# Altium project ProjectTower3.PrjPCB
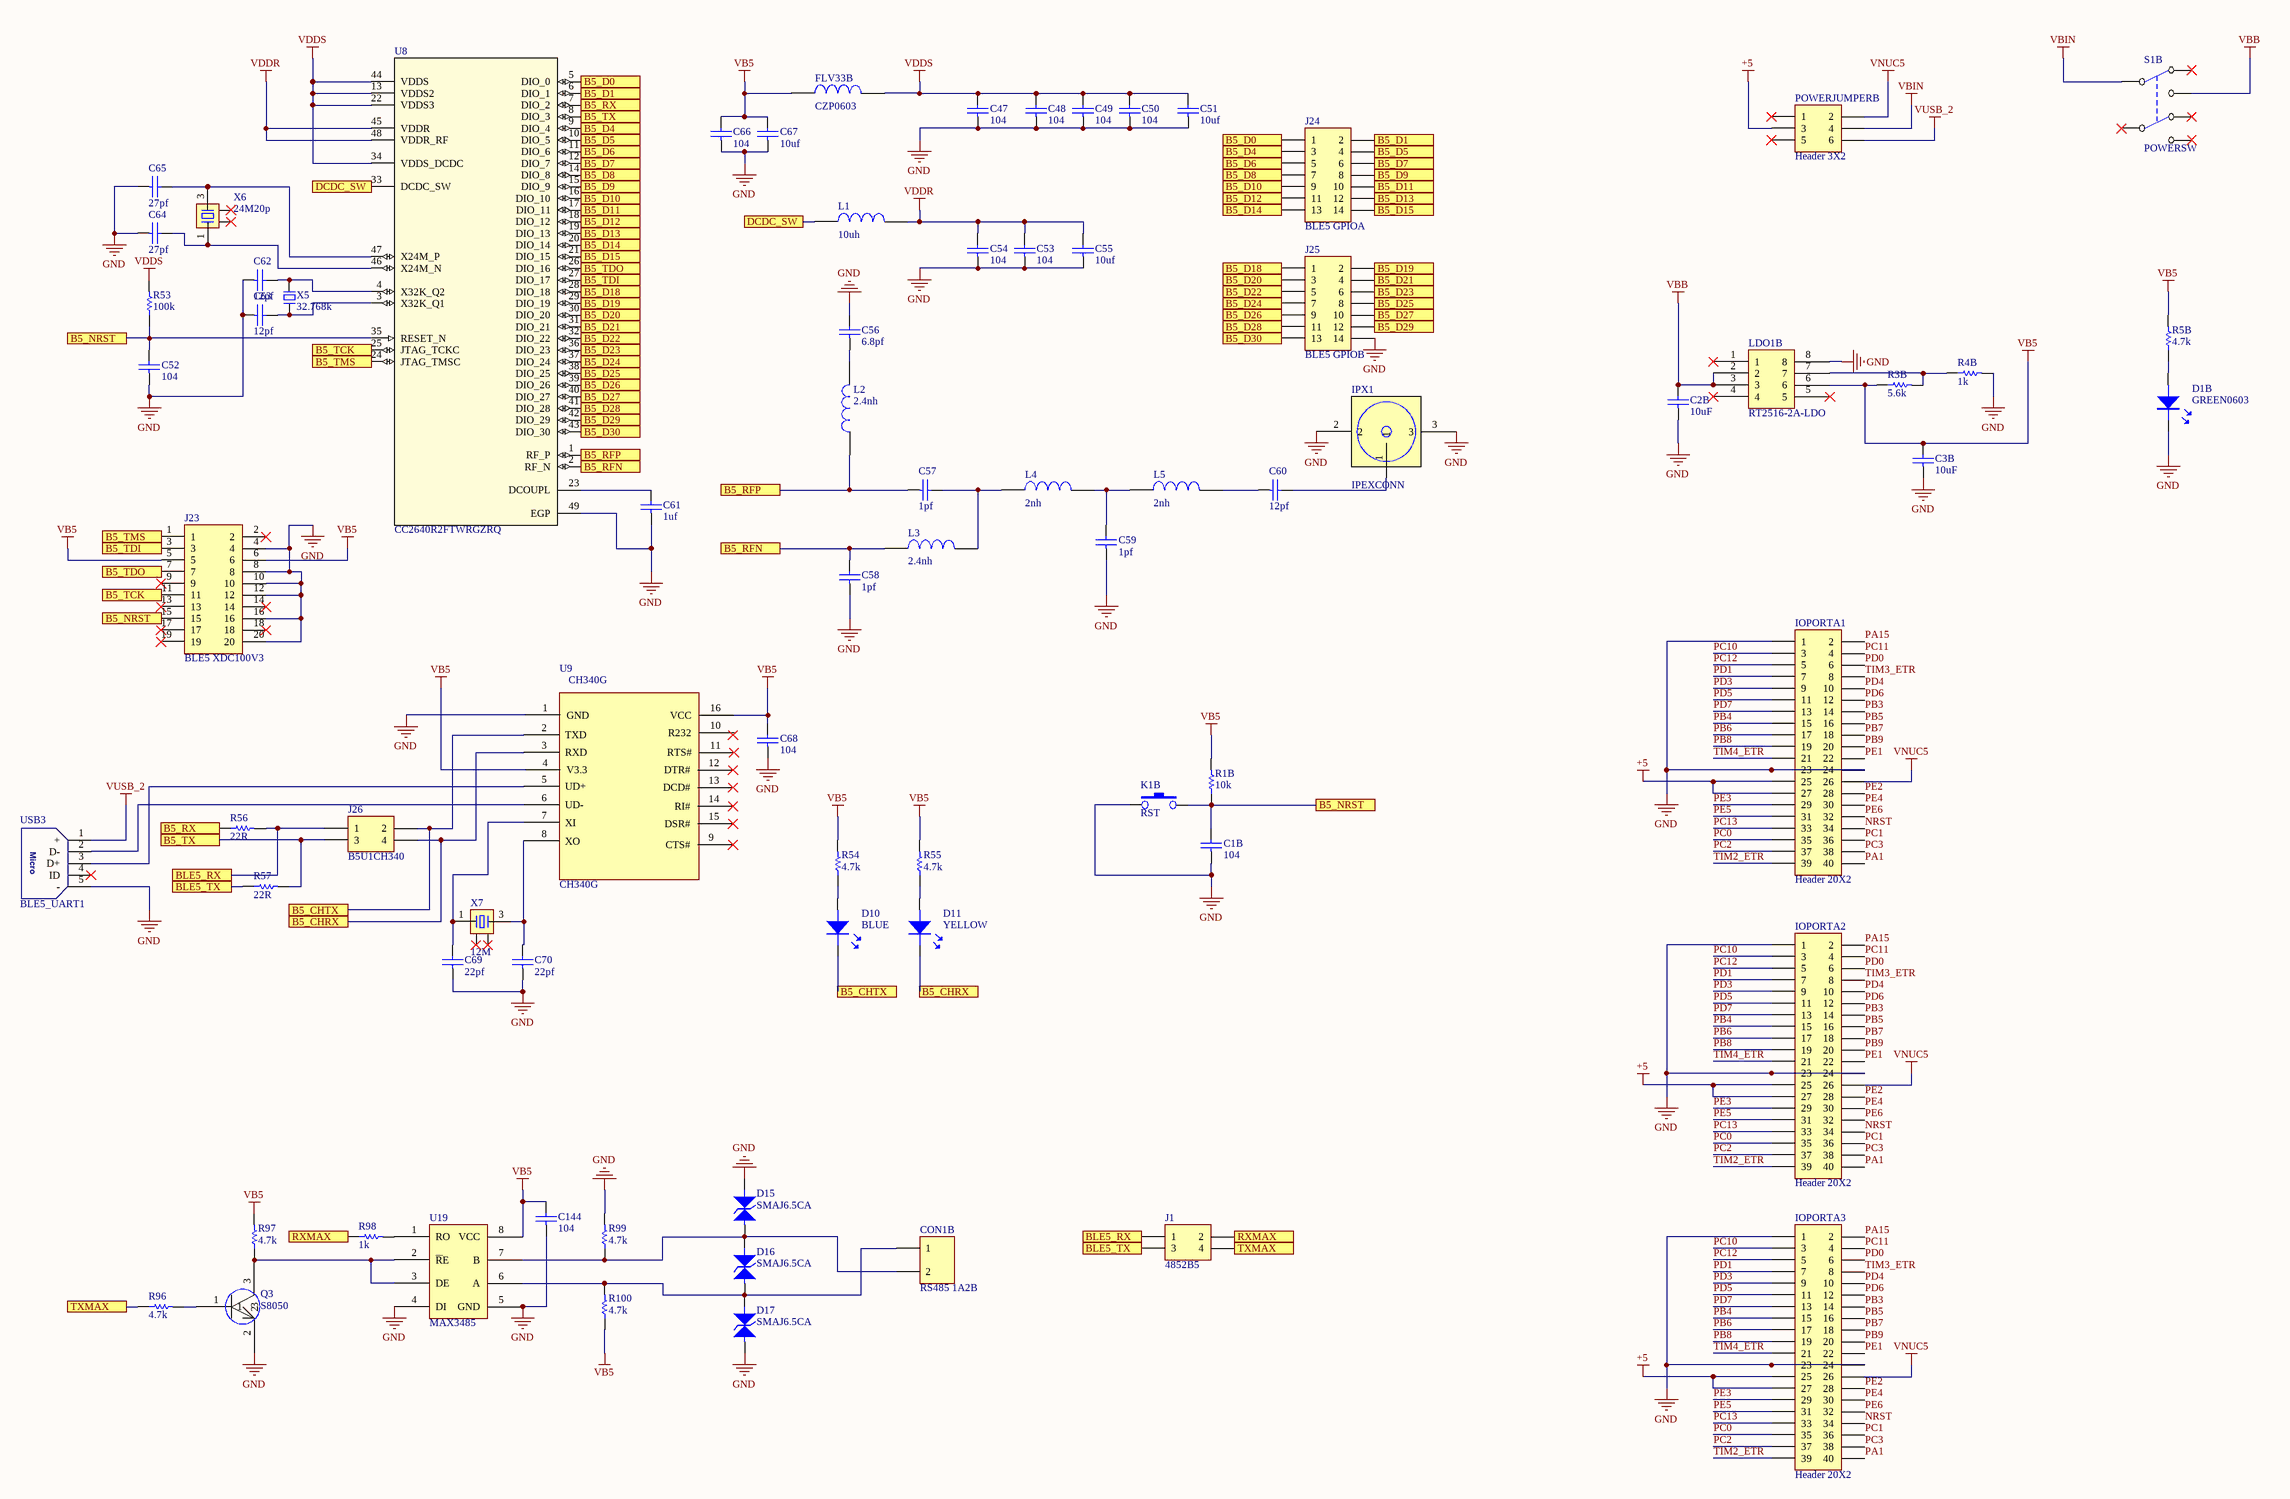
[diagram p0: Sheet3.SchDoc]
1 sheet, 76 parts. Net scope: flat (ports and power ports of the same name join across sheets).
Board file: PCB3.PcbDoc

## Sheet Sheet3.SchDoc
size A2

### Parts
C1B  104  [0603C]
C2B  10uF  [0805C]
C3B  10uF  [0805C]
C47  104  [0603C]
C48  104  [0603C]
C49  104  [0603C]
C50  104  [0603C]
C51  10uf  [0805C]
C52  104  [0603C]
C53  104  [0603C]
C54  104  [0603C]
C55  10uf  [0805C]
C56  6.8pf  [0603C]
C57  1pf  [0603C]
C58  1pf  [0603C]
C59  1pf  [0603C]
C60  12pf  [0603C]
C61  1uf  [0805C]
C62  12pf  [0603C]
C63  12pf  [0603C]
C64  27pf  [0603C]
C65  27pf  [0603C]
C66  104  [0603C]
C67  10uf  [0805C]
C68  104  [0603C]
C69  22pf  [0603C]
C70  22pf  [0603C]
C144  104  [0805C]
CON1B  RS485 1A2B  [KF301-2P]
D1B  GREEN0603  [LED-0603G]
D10  BLUE  [LED-0603B]
D11  YELLOW  [LED-0603Y]
D15  SMAJ6.5CA  [SMA/DO-214AC]
D16  SMAJ6.5CA  [SMA/DO-214AC]
D17  SMAJ6.5CA  [SMA/DO-214AC]
FLV33B  CZP0603  [0603L]
IOPORTA1  Header 20X2  [HDR2X20]
IOPORTA2  Header 20X2  [HDR2X20]
IOPORTA3  Header 20X2  [HDR2X20]
IPX1  IPEXCONN  [IPEXCONN]
J1  4852B5  [HDR2X2]
J23  BLE5 XDC100V3  [IDC2.54-20P]
J24  BLE5 GPIOA  [HDR2X7]
J25  BLE5 GPIOB  [HDR2X7]
J26  B5U1CH340  [HDR2X2]
K1B  RST  [DIP-6X6X5]
L1  10uh  [0805L]
L2  2.4nh  [0603L]
L3  2.4nh  [0603L]
L4  2nh  [0603L]
L5  2nh  [0603L]
LDO1B  RT2516-2A-LDO  [SOP8]
POWERJUMPERB  Header 3X2  [HDR2X3]
Q3  S8050  [SOT23]
R1B  10k  [0603R]
R3B  5.6k  [0603R]
R4B  1k  [0603R]
R5B  4.7k  [0603R]
R53  100k  [0603R]
R54  4.7k  [0603R]
R55  4.7k  [0603R]
R56  22R  [0603R]
R57  22R  [0603R]
R96  4.7k  [0603R]
R97  4.7k  [0603R]
R98  1k  [0603R]
R99  4.7k  [0603R]
R100  4.7k  [0603R]
S1B  POWERSW  [KFT DIP-7X7]
U8  CC2640R2FTWRGZRQ  [RGZ0048N]
U9  CH340G  [SOIC127P600X170-16N]
U19  MAX3485  [SOP8]
USB3  BLE5_UART1  [USB-micro_B]
X5  32.768k  [X3215]
X6  24M20p  [OSC 3225-4P]
X7  12M  [OSC 3225-4P]

### Ports
B5_CHRX, B5_CHTX, B5_D0, B5_D1, B5_D4, B5_D5, B5_D6, B5_D7, B5_D8, B5_D9, B5_D10, B5_D11, B5_D12, B5_D13, B5_D14, B5_D15, B5_D18, B5_D19, B5_D20, B5_D21, B5_D22, B5_D23, B5_D24, B5_D25, B5_D26, B5_D27, B5_D28, B5_D29, B5_D30, B5_NRST, B5_RFN, B5_RFP, B5_RX, B5_TCK, B5_TDI, B5_TDO, B5_TMS, B5_TX, BLE5_RX, BLE5_TX, DCDC_SW, RXMAX, TXMAX

### Nets
+5: IOPORTA1.25 IOPORTA1.27 IOPORTA2.25 IOPORTA2.27 IOPORTA3.25 IOPORTA3.27 POWERJUMPERB.3
GND: C1B.1 C2B.1 C3B.1 C47.1 C48.1 C49.1 C50.1 C51.1 C52.1 C53.1 C54.1 C55.1 C56.2 C58.1 C59.1 C61.1 C62.1 C63.1 C64.1 C65.1 C66.1 C67.1 C68.1 C69.1 C70.1 C144.1 D1B.K D15.K D17.A IOPORTA1.1 IOPORTA1.23 IOPORTA1.24 IOPORTA2.1 IOPORTA2.23 IOPORTA2.24 IOPORTA3.1 IOPORTA3.23 IOPORTA3.24 IPX1.2 IPX1.3 J23.4 J23.8 J23.10 J23.12 J23.16 J23.20 J25.14 K1B.1 LDO1B.8 Q3.2 R4B.2 R99.2 U8.49(EGP) U9.1(GND) U19.4(DI) U19.5(GND) USB3.5(-)
VB5: C3B.2 C66.2 C67.2 C68.2 C144.2 FLV33B.1 J23.5 J23.6 LDO1B.6 R1B.2 R3B.1 R5B.2 R54.2 R55.2 R97.2 R100.1 U9.4(V3.3) U9.16(VCC) U19.8(VCC)
VBB: C2B.2 LDO1B.2 LDO1B.3 S1B.1
VBIN: POWERJUMPERB.4 S1B.2
VDDR: C53.2 C54.2 C55.2 L1.2 U8.45(VDDR) U8.48(VDDR_RF)
VDDS: C47.2 C48.2 C49.2 C50.2 C51.2 FLV33B.2 R53.2 U8.13(VDDS2) U8.22(VDDS3) U8.34(VDDS_DCDC) U8.44(VDDS)
VNUC5: IOPORTA1.26 IOPORTA2.26 IOPORTA3.26 POWERJUMPERB.2
VUSB_2: POWERJUMPERB.6 USB3.1(+)
NRST: IOPORTA1.34 IOPORTA2.34 IOPORTA3.34
PA1: IOPORTA1.40 IOPORTA2.40 IOPORTA3.40
PA15: IOPORTA1.2 IOPORTA2.2 IOPORTA3.2
PB3: IOPORTA1.14 IOPORTA2.14 IOPORTA3.14
PB4: IOPORTA1.15 IOPORTA2.15 IOPORTA3.15
PB5: IOPORTA1.16 IOPORTA2.16 IOPORTA3.16
PB6: IOPORTA1.17 IOPORTA2.17 IOPORTA3.17
PB7: IOPORTA1.18 IOPORTA2.18 IOPORTA3.18
PB8: IOPORTA1.19 IOPORTA2.19 IOPORTA3.19
PB9: IOPORTA1.20 IOPORTA2.20 IOPORTA3.20
PC0: IOPORTA1.35 IOPORTA2.35 IOPORTA3.35
PC1: IOPORTA1.36 IOPORTA2.36 IOPORTA3.36
PC2: IOPORTA1.37 IOPORTA2.37 IOPORTA3.37
PC3: IOPORTA1.38 IOPORTA2.38 IOPORTA3.38
PC10: IOPORTA1.3 IOPORTA2.3 IOPORTA3.3
PC11: IOPORTA1.4 IOPORTA2.4 IOPORTA3.4
PC12: IOPORTA1.5 IOPORTA2.5 IOPORTA3.5
PC13: IOPORTA1.33 IOPORTA2.33 IOPORTA3.33
PD0: IOPORTA1.6 IOPORTA2.6 IOPORTA3.6
PD1: IOPORTA1.7 IOPORTA2.7 IOPORTA3.7
PD3: IOPORTA1.9 IOPORTA2.9 IOPORTA3.9
PD4: IOPORTA1.10 IOPORTA2.10 IOPORTA3.10
PD5: IOPORTA1.11 IOPORTA2.11 IOPORTA3.11
PD6: IOPORTA1.12 IOPORTA2.12 IOPORTA3.12
PD7: IOPORTA1.13 IOPORTA2.13 IOPORTA3.13
PE1: IOPORTA1.22 IOPORTA2.22 IOPORTA3.22
PE2: IOPORTA1.28 IOPORTA2.28 IOPORTA3.28
PE3: IOPORTA1.29 IOPORTA2.29 IOPORTA3.29
PE4: IOPORTA1.30 IOPORTA2.30 IOPORTA3.30
PE5: IOPORTA1.31 IOPORTA2.31 IOPORTA3.31
PE6: IOPORTA1.32 IOPORTA2.32 IOPORTA3.32
TIM2_ETR: IOPORTA1.39 IOPORTA2.39 IOPORTA3.39
TIM3_ETR: IOPORTA1.8 IOPORTA2.8 IOPORTA3.8
TIM4_ETR: IOPORTA1.21 IOPORTA2.21 IOPORTA3.21
NetC1B_2: C1B.2 C52.2 J23.15 K1B.3 R1B.1 R53.1 U8.35(RESET_N) ; port B5_NRST
NetC56_1: C56.1 L2.2
NetC57_1: C57.1 L2.1 U8.1(RF_P) ; port B5_RFP
NetC57_2: C57.2 L3.2 L4.1
NetC58_2: C58.2 L3.1 U8.2(RF_N) ; port B5_RFN
NetC59_2: C59.2 L4.2 L5.1
NetC60_1: C60.1 L5.2
NetC60_2: C60.2 IPX1.1
NetC61_2: C61.2 U8.23(DCOUPL)
NetC62_2: C62.2 U8.4(X32K_Q2) X5.2
NetC63_2: C63.2 U8.3(X32K_Q1) X5.1
NetC64_2: C64.2 U8.46(X24M_N) X6.1
NetC65_2: C65.2 U8.47(X24M_P) X6.3
NetC69_2: C69.2 U9.7(XI) X7.1
NetC70_2: C70.2 U9.8(XO) X7.3
NetCON1B_1: CON1B.1 D16.A D17.K R100.2 U19.6(A)
NetCON1B_2: CON1B.2 D15.A D16.K R99.1 U19.7(B)
NetD1B_A: D1B.A R5B.1
NetD10_A: D10.A R54.1
NetD10_K: D10.K J26.2 U9.2(TXD) ; port B5_CHTX
NetD11_A: D11.A R55.1
NetD11_K: D11.K J26.4 U9.3(RXD) ; port B5_CHRX
NetJ1_1: J1.1 J26.1 R56.2 ; port BLE5_RX
NetJ1_2: J1.2 R98.1 ; port RXMAX
NetJ1_3: J1.3 R57.1 ; port BLE5_TX
NetJ1_4: J1.4 R96.1 ; port TXMAX
NetJ23_1: J23.1 U8.24(JTAG_TMSC) ; port B5_TMS
NetJ23_3: J23.3 U8.27(DIO_17) ; port B5_TDI
NetJ23_7: J23.7 U8.26(DIO_16) ; port B5_TDO
NetJ23_11: J23.11 U8.25(JTAG_TCKC) ; port B5_TCK
NetJ24_1: J24.1 U8.5(DIO_0) ; port B5_D0
NetJ24_2: J24.2 U8.6(DIO_1) ; port B5_D1
NetJ24_3: J24.3 U8.9(DIO_4) ; port B5_D4
NetJ24_4: J24.4 U8.10(DIO_5) ; port B5_D5
NetJ24_5: J24.5 U8.11(DIO_6) ; port B5_D6
NetJ24_6: J24.6 U8.12(DIO_7) ; port B5_D7
NetJ24_7: J24.7 U8.14(DIO_8) ; port B5_D8
NetJ24_8: J24.8 U8.15(DIO_9) ; port B5_D9
NetJ24_9: J24.9 U8.16(DIO_10) ; port B5_D10
NetJ24_10: J24.10 U8.17(DIO_11) ; port B5_D11
NetJ24_11: J24.11 U8.18(DIO_12) ; port B5_D12
NetJ24_12: J24.12 U8.19(DIO_13) ; port B5_D13
NetJ24_13: J24.13 U8.20(DIO_14) ; port B5_D14
NetJ24_14: J24.14 U8.21(DIO_15) ; port B5_D15
NetJ25_1: J25.1 U8.28(DIO_18) ; port B5_D18
NetJ25_2: J25.2 U8.29(DIO_19) ; port B5_D19
NetJ25_3: J25.3 U8.30(DIO_20) ; port B5_D20
NetJ25_4: J25.4 U8.31(DIO_21) ; port B5_D21
NetJ25_5: J25.5 U8.32(DIO_22) ; port B5_D22
NetJ25_6: J25.6 U8.36(DIO_23) ; port B5_D23
NetJ25_7: J25.7 U8.37(DIO_24) ; port B5_D24
NetJ25_8: J25.8 U8.38(DIO_25) ; port B5_D25
NetJ25_9: J25.9 U8.39(DIO_26) ; port B5_D26
NetJ25_10: J25.10 U8.40(DIO_27) ; port B5_D27
NetJ25_11: J25.11 U8.41(DIO_28) ; port B5_D28
NetJ25_12: J25.12 U8.42(DIO_29) ; port B5_D29
NetJ25_13: J25.13 U8.43(DIO_30) ; port B5_D30
NetJ26_3: J26.3 R57.2 U8.8(DIO_3) ; port B5_TX
NetL1_1: L1.1 U8.33(DCDC_SW) ; port DCDC_SW
NetLDO1B_7: LDO1B.7 R3B.2 R4B.1
NetQ3_1: Q3.1 R96.2
NetQ3_3: Q3.3 R97.1 U19.2(~{R}E) U19.3(DE)
NetR56_1: R56.1 U8.7(DIO_2) ; port B5_RX
NetR98_2: R98.2 U19.1(RO)
NetU9_5: U9.5(UD+) USB3.3(D+)
NetU9_6: U9.6(UD-) USB3.2(D-)

Not connected (* = marked no-connect by the designer): J23 2* 9* 13* 14* 17* 18* 19*; LDO1B 1* 4* 5*; POWERJUMPERB 1* 5*; S1B 3* 4* 5* 6*; U9 9(CTS#)* 10(R232) 11(RTS#)* 12(DTR#)* 13(DCD#)* 14(RI#)* 15(DSR#)*; USB3 4(ID)*; X6 2* 4*; X7 2* 4*

### Notes on the sheet
- (in symbol Micro-USB) Micro

### Library data of the parts
C1B C2B C3B C47-C70 C144 = CAP: 无极性电容
CON1B = Connector-2P
D1B D10 D11 = LED
D15-D17 = TVS: 双向瞬态抑制二极管
FLV33B L1-L5 = INDUCTOR
IOPORTA1-IOPORTA3 = Header 20X2: Header, 20-Pin, Dual row; LatestRevisionDate: 17-Jul-2002; LatestRevisionNote: Re-released for DXP Platform.; Publisher: Altium Limited
J1 J26 = Header 2X2: Header, 2-Pin, Dual row; LatestRevisionDate: 17-Jul-2002; LatestRevisionNote: Re-released for DXP Platform.; Publisher: Altium Limited
J23 = IDC-20P
J24 J25 = Header 7X2: Header, 7-Pin, Dual row; LatestRevisionDate: 17-Jul-2002; LatestRevisionNote: Re-released for DXP Platform.; Publisher: Altium Limited
K1B = KEY
LDO1B = RT2516
POWERJUMPERB = Header 3X2: Header, 3-Pin, Dual row; LatestRevisionDate: 17-Jul-2002; LatestRevisionNote: Re-released for DXP Platform.; Publisher: Altium Limited
Q3 = S9014
R1B R3B R4B R5B R53-R57 R96-R100 = RES
S1B = KFT DIP-7X7
U8 = CC2640R2FTWRGZRQ: Imported; PartNumber: CC2640R2FTWRGZQ1; Manufacturer: Texas Instruments; RefDes: RefDes; TYPE: TYPE; Value: Value
U9 = Component_1
U19 = MAX481
USB3 = Micro-USB
X5 = XTAL-2P: 2脚无源脚晶振
X6 X7 = XTAL-4P: 4脚无源晶振